# EAGLE design SafetyChain (EAGLE 6.4)
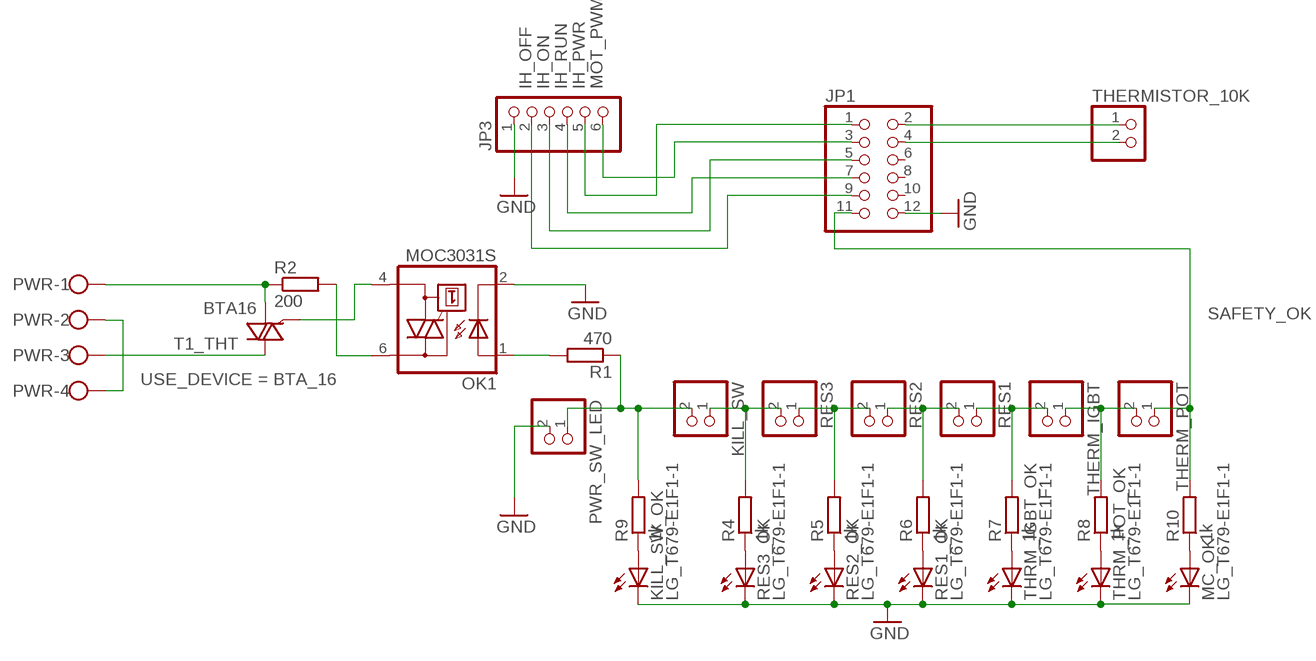
[diagram p0: schematic, sheet 1]

## Parts
JP1  PINHD-2X6  [2X06]
JP3  PINHD-1X6  [1X06]
KILL_SW  PINHD-1X2  [1X02]
KILL_SW_OK  LG_T679-E1F1-1  [PLCC2]
MC_OK  LG_T679-E1F1-1  [PLCC2]
OK1  MOC3031S  [DIL6-SMD]
PWR  W237-4  [W237-4]
PWR_SW_LED  PINHD-1X2  [1X02]
R1  470  R-EU_M0805  [M0805]
R2  200  R-EU_M0805  [M0805]
R4  1k  R-EU_M0805  [M0805]
R5  1k  R-EU_M0805  [M0805]
R6  1k  R-EU_M0805  [M0805]
R7  1k  R-EU_M0805  [M0805]
R8  1k  R-EU_M0805  [M0805]
R9  1k  R-EU_M0805  [M0805]
R10  1k  R-EU_M0805  [M0805]
RES1  PINHD-1X2  [1X02]
RES1_OK  LG_T679-E1F1-1  [PLCC2]
RES2  PINHD-1X2  [1X02]
RES2_OK  LG_T679-E1F1-1  [PLCC2]
RES3  PINHD-1X2  [1X02]
RES3_OK  LG_T679-E1F1-1  [PLCC2]
T1_THT  BTA16  BT138-V  [TO220BV]
THERM_IGBT  PINHD-1X2  [1X02]
THERM_POT  PINHD-1X2  [1X02]
THERMISTOR_10K  PINHD-1X2  [1X02]
THRM_IGBT_OK  LG_T679-E1F1-1  [PLCC2]
THRM_POT_OK  LG_T679-E1F1-1  [PLCC2]

## Nets
3V3: JP1.4 THERMISTOR_10K.2
GND: JP1.12 JP3.1 KILL_SW_OK.C MC_OK.C OK1.2(C) PWR_SW_LED.2 RES1_OK.C RES2_OK.C RES3_OK.C THRM_IGBT_OK.C THRM_POT_OK.C
IH_OFF: JP1.9 JP3.2
IH_ON: JP1.5 JP3.3
IH_PWR: JP1.1 JP3.5
IH_RUN: JP1.7 JP3.4
IH_THERMISTOR: JP1.2 THERMISTOR_10K.1
L_IN: PWR.1 R2.1 T1_THT.T1(A1)
L_OUT: PWR.3 T1_THT.T2(A2)
MOT_PWM: JP1.3 JP3.6
N$1: OK1.1(A) R1.2
N$2: OK1.6(A2) R2.2
N$3: R8.2 THERM_IGBT.1 THERM_POT.2
N$4: R7.2 RES1.1 THERM_IGBT.2
N$5: R6.2 RES1.2 RES2.1
N$6: R5.2 RES2.2 RES3.1
N$7: KILL_SW.1 R4.2 RES3.2
N$8: KILL_SW.2 PWR_SW_LED.1 R1.1 R9.2
N$9: R4.1 RES3_OK.A
N$10: R5.1 RES2_OK.A
N$11: R6.1 RES1_OK.A
N$12: R7.1 THRM_IGBT_OK.A
N$13: R8.1 THRM_POT_OK.A
N$14: MC_OK.A R10.1
N$15: KILL_SW_OK.A R9.1
PWR_N: PWR.2 PWR.4
SAFETY_OK: JP1.11 R10.2 THERM_POT.1
TRIAC_DRV: OK1.4(A1) T1_THT.G
Unconnected: JP1.6 JP1.8 JP1.10

## Library data of the parts
JP1 = pinhead:PINHD-2X6: PIN HEADER
JP3 = pinhead:PINHD-1X6: PIN HEADER
KILL_SW PWR_SW_LED RES1-RES3 THERM_IGBT THERM_POT THERMISTOR_10K = pinhead:PINHD-1X2: PIN HEADER
KILL_SW_OK MC_OK RES1_OK RES2_OK RES3_OK THRM_IGBT_OK THRM_POT_OK = led:*_T679-?-1: LC TOPLED® Low Current LED Source: http://catalog.osram-os.com .. LG_LS_LY_T679_OBS.pdf; COLOR: green
OK1 = optocoupler:MOC30*: 6-Pin DIP Zero-Cross Optoisolators Triac Driver Output (250/400 Volt Peak) Source: http://www.fairchildsemi.com/ds/MO/MOC3043-M.pdf; MF: FAIRCHILD SEMICONDUCTOR; MPN: MOC3031SM; OC_FARNELL: unknown; OC_NEWARK: 34C1335
PWR = con-wago-500:W237-4: WAGO SCREW CLAMP; OC_FARNELL: unknown; OC_NEWARK: unknown
R1 R2 R4-R10 = rcl:R-EU_: RESISTOR, European symbol
T1_THT = triac:BT138: TRIAC Source: http://www.semiconductors.philips.com BT138_SERIES_2.pdf; USE_DEVICE: BTA_16

## Board
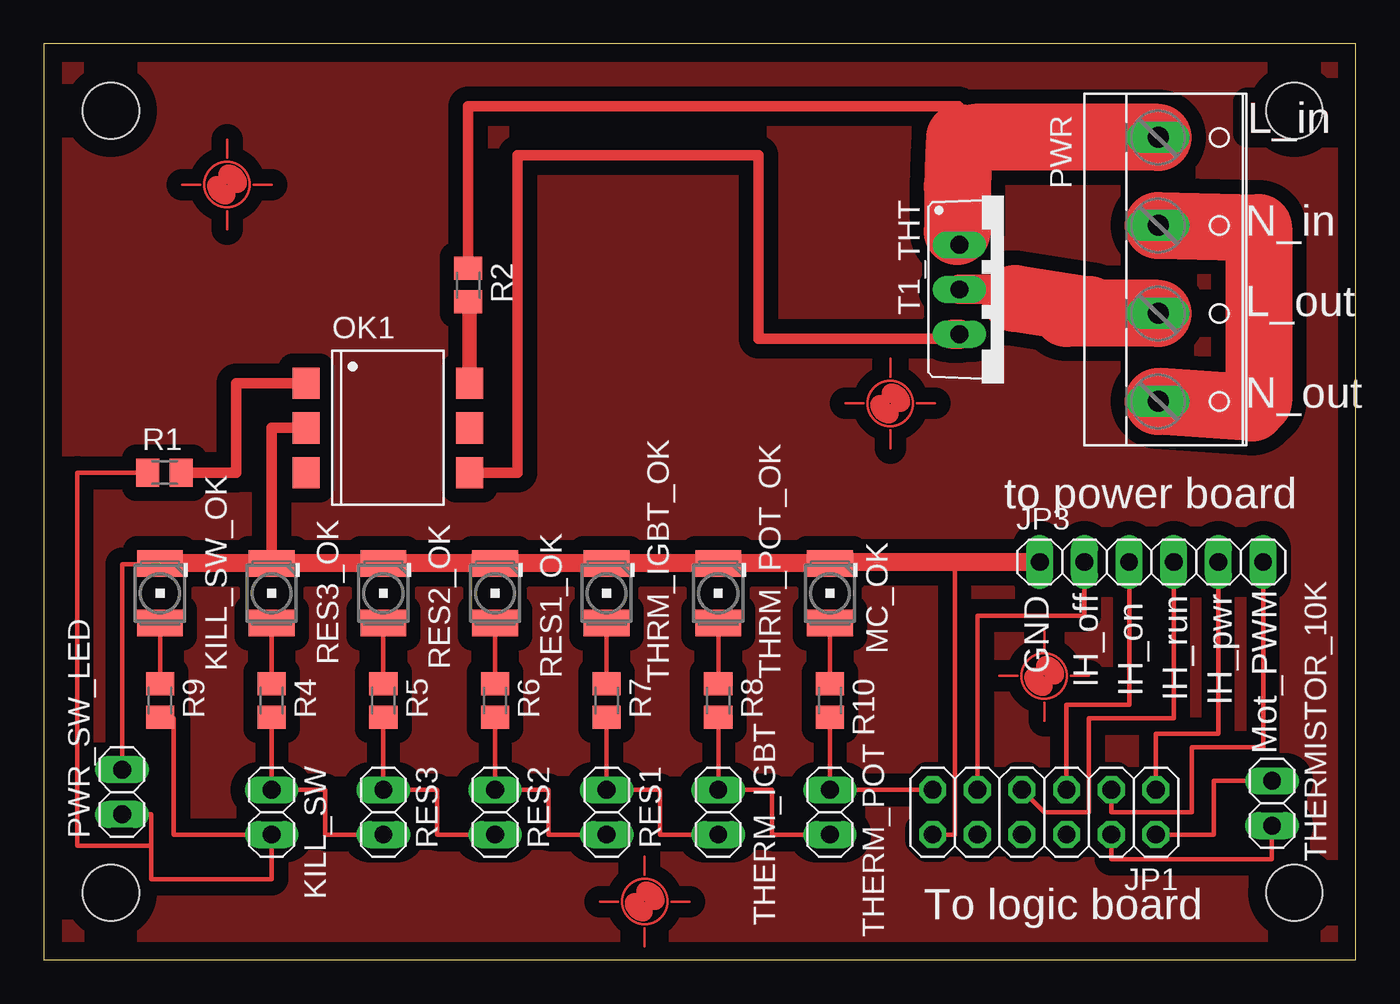
[diagram p1: board, top side]
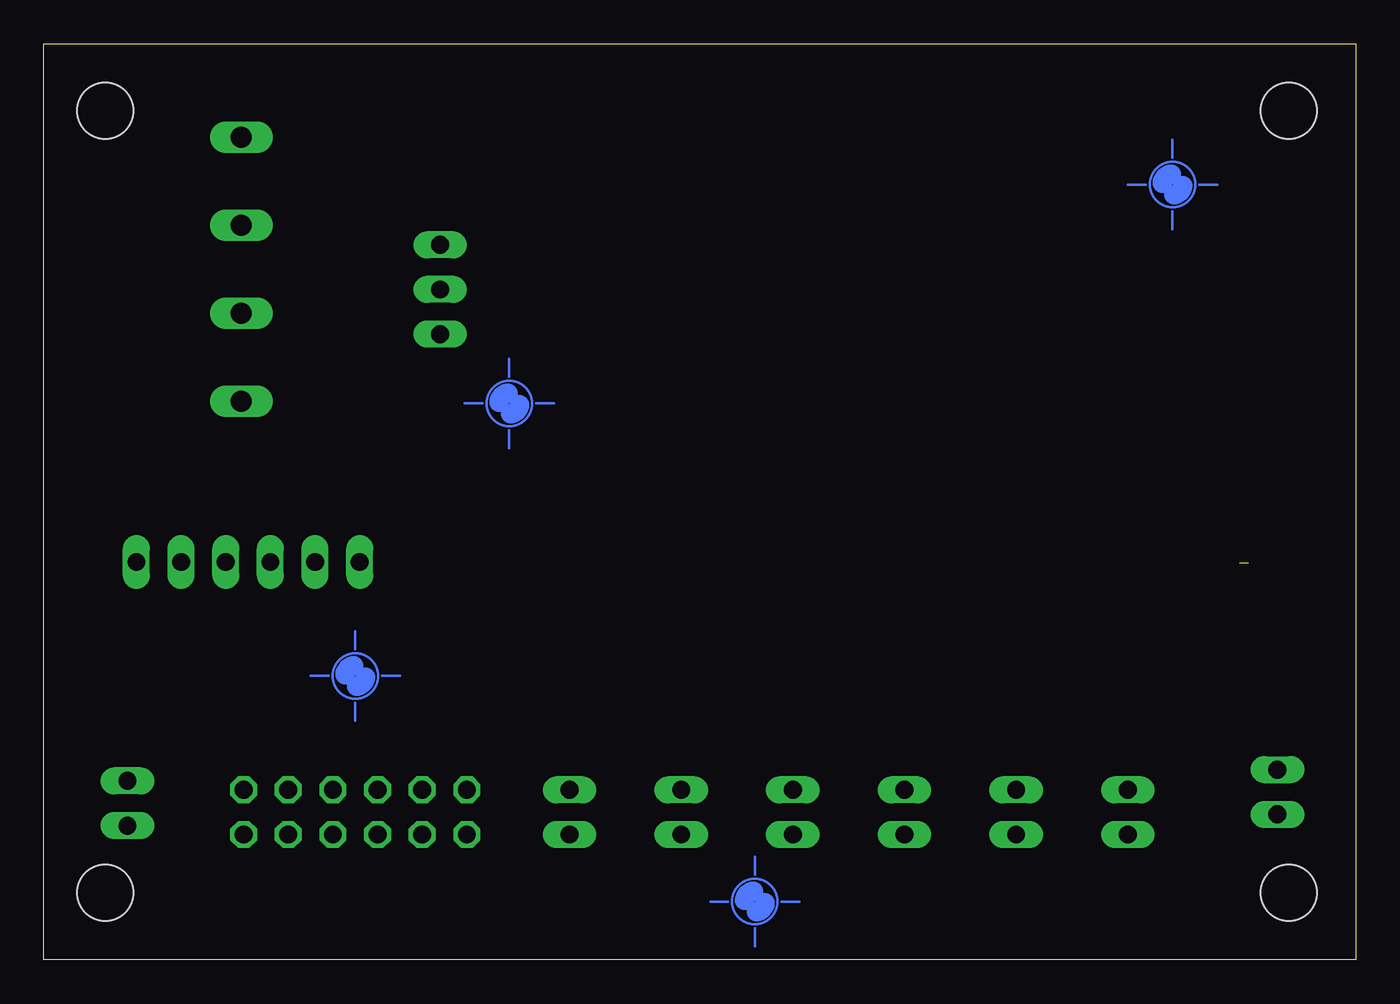
[diagram p2: board, bottom side, seen from below]

Size 74.6 x 52.06 mm. Coordinates in mm from the lower left corner, seen from the top.
Outline: 0,0 74.6,0 74.6,52.06 0,52.06 0,0
Copper layers (1*16): Top 0.035mm / dielectric 1.5mm / Bottom 0.035mm
Design rules "default": minimum track width 10mil, minimum drill 24mil, track to track 8mil, track to pad 8mil, pad to pad 8mil, via to via 8mil, smd to smd 8mil, copper to edge 40mil, drill to drill 8mil, minimum pad ring 10mil, minimum via ring 8mil, stop-mask expansion 4mil, vias tented up to drill 0mil, thermal gap 10mil
Holes 3.2 mm at 3.81,48.26 3.81,3.81 71.12,3.81 71.12,48.26

### Footprints (pad centres in the part's own frame; a part is rotated, then mirrored left to right if it is on the bottom)
2X06 = drill 1.016 octagon: 1 -6.35,-1.27; 2 -6.35,1.27; 3 -3.81,-1.27; 4 -3.81,1.27; 5 -1.27,-1.27; 6 -1.27,1.27; 7 1.27,-1.27; 8 1.27,1.27; 9 3.81,-1.27; 10 3.81,1.27; 11 6.35,-1.27; 12 6.35,1.27
1X06 = drill 1.016 long: 1 -6.35,0; 2 -3.81,0; 3 -1.27,0; 4 1.27,0; 5 3.81,0; 6 6.35,0
1X02 = drill 1.016 long: 1 -1.27,0; 2 1.27,0
PLCC2 = smd 2.6 x 1.5: A 0,1.7; C 0,-1.7
DIL6-SMD = smd 1.78 x 1.52: 1 -2.54,-4.645; 2 0,-4.645; 3 2.54,-4.645; 4 2.54,4.645; 5 0,4.645; 6 -2.54,4.645
W237-4 = drill 1.194 long: 1 -7.5,-1.27; 2 -2.5,-1.27; 3 2.5,-1.27; 4 7.5,-1.27
M0805 = smd 1.3 x 1.6: 1 -0.95,0; 2 0.95,0
TO220BV = drill 1.016 long: G 2.54,-2.54; T1 -2.54,-2.54; T2 0,-2.54

### Placement (x,y rotation side)
JP1  56.9,8.38 180 top
JP3  62.99,22.61 0 top
KILL_SW  12.95,8.38 270 top
KILL_SW_OK  6.6,20.83 180 top
MC_OK  44.7,20.83 180 top
OK1  19.56,30.23 270 top
PWR  64.64,39.24 270 top
PWR_SW_LED  4.45,9.53 90 top
R1  6.86,27.69 0 top
R2  24.13,38.35 270 top
R4  12.95,14.73 270 top
R5  19.3,14.73 270 top
R6  25.65,14.73 270 top
R7  32,14.73 270 top
R8  38.35,14.73 270 top
R9  6.6,14.73 270 top
R10  44.7,14.73 270 top
RES1  32,8.38 270 top
RES1_OK  25.65,20.83 180 top
RES2  25.65,8.38 270 top
RES2_OK  19.3,20.83 180 top
RES3  19.3,8.38 270 top
RES3_OK  12.95,20.83 180 top
T1_THT  54.61,38.1 270 top
THERM_IGBT  38.35,8.38 270 top
THERM_POT  44.7,8.38 270 top
THERMISTOR_10K  69.85,8.89 270 top
THRM_IGBT_OK  32,20.83 180 top
THRM_POT_OK  38.35,20.83 180 top
U$1  [PASS-ROUND]  10.41,44.07 0 top
U$2  [PASS-ROUND]  48.13,31.62 0 top
U$3  [PASS-ROUND]  56.9,16.13 0 top
U$4  [PASS-ROUND]  34.16,3.3 0 top

### Tracks (layer width: path | path; a pad name or v marks a point on that pad's centre or on a via)
3V3
  Top 0.254: THERMISTOR_10K.2 69.85,5.71 60.71,5.71 JP1.4
GND  (1 unrouted)
  Top 0.254: JP1.12 51.82,7.11 51.82,22.61 | 44.7,22.61 MC_OK.C | 6.1,22.53 6.1,22.61 | PWR_SW_LED.2 4.45,22.48 7.62,22.48 7.62,22.53
  Top 0.61: OK1.2 12.95,30.23 RES3_OK.C
  Top 1.016: 44.7,22.61 51.82,22.61 JP3.1 | MC_OK.C THRM_POT_OK.C THRM_IGBT_OK.C RES1_OK.C RES2_OK.C RES3_OK.C 7.62,22.53 6.1,22.53
IH_OFF
  Top 0.254: JP3.2 59.18,19.56 53.09,19.56 JP1.9
IH_ON
  Top 0.254: JP3.3 61.72,14.48 58.17,14.48 JP1.5
IH_PWR
  Top 0.254: JP1.1 63.25,12.83 66.8,12.83 JP3.5
IH_RUN
  Top 0.254: JP1.7 56.9,8.38 59.44,8.38 59.44,13.72 64.26,13.72 JP3.4
IH_THERMISTOR
  Top 0.254: JP1.2 66.55,7.11 66.55,10.16 THERMISTOR_10K.1
L_IN
  Top 0.61: R2.1 24.13,48.51 52.02,48.51 52.02,45.73
  Top 1.676: 52.96,46.74 52.07,46.74 | T1_THT.T1 51.56,41.91
  Top 1.778: 51.94,41.4 T1_THT.T1
  Top 3.81: PWR.1 52.96,46.74 | 52.07,46.74 52.02,45.73 51.94,43.94 51.94,41.4
L_OUT
  Top 1.676: T1_THT.T2 53.98,38.1 55.24,37.59 | 59.44,36.96 58.17,37.59
  Top 1.778: 58.17,37.08 58.17,36.74 58.17,36.2 57.53,37.34 58.17,37.08 | 58.17,37.08 58.17,37.59
  Top 3.81: PWR.3 58.17,36.74 | 55.24,37.59 59.44,36.96
MOT_PWM
  Top 0.254: JP1.3 60.71,8.38 65.28,8.38 65.28,12.06 69.34,12.06 JP3.6
N$1
  Top 0.61: R1.2 10.92,27.69 10.92,32.77 OK1.1
N$2
  Top 0.813: R2.2 24.2,37.4 OK1.6
N$3
  Top 0.254: R8.2 THERM_IGBT.1 41.4,9.65 41.4,7.11 THERM_POT.2
N$4
  Top 0.254: R7.2 RES1.1 35.05,9.65 35.05,7.11 THERM_IGBT.2
N$5
  Top 0.254: R6.2 RES2.1 28.7,9.65 28.7,7.11 RES1.2
N$6
  Top 0.254: R5.2 RES3.1 22.35,9.65 22.35,7.11 RES2.2
N$7
  Top 0.254: R4.2 KILL_SW.1 16,9.65 16,7.11 RES3.2
N$8
  Top 0.254: R9.2 7.37,13.72 7.37,7.11 KILL_SW.2 12.95,4.57 6.1,4.57 6.1,6.48 | 6.1,6.48 1.91,6.48 1.91,27.69 R1.1 | PWR_SW_LED.1 6.1,8.26 6.1,6.48
N$9
  Top 0.254: RES3_OK.A R4.1
N$10
  Top 0.254: RES2_OK.A R5.1
N$11
  Top 0.254: RES1_OK.A R6.1
N$12
  Top 0.254: THRM_IGBT_OK.A R7.1
N$13
  Top 0.254: THRM_POT_OK.A R8.1
N$14
  Top 0.254: MC_OK.A R10.1
N$15
  Top 0.254: KILL_SW_OK.A R9.1
N$16
  pour Top (isolate 0.813): 1.27,50.8 1.27,1.27 73.66,1.27 73.66,50.8
PWR_N
  Top 2.54: 69.09,31.75 68.71,31.37
  Top 3.81: PWR.2 69.09,41.62 69.09,31.75 | 68.71,31.37 PWR.4
SAFETY_OK
  Top 0.254: R10.2 THERM_POT.1 JP1.11
TRIAC_DRV
  Top 0.61: OK1.4 26.92,27.69 26.92,45.72 40.64,45.72 40.64,35.31 52.07,35.31 T1_THT.G
  Top 1.676: T1_THT.G 51.69,35.56

### Text on the board
Top: L_in
tNames: L_in | N_in | L_out | N_out | to power board | GND | IH_off | IH_on | IH_run | IH_pwr | Mot_PWM | To logic board